# Altium schematic sheet Buck Boost Converter.SchDoc
size A4; SheetNumber: 1; SheetTotal: 1; SPICEModelCacheBIKMLFOA: <root> / <DocumentId>BIKMLFOA</DocumentId> / <CacheFrame Number="0"> / <Model Name="d188" Kind="MDL"> / <Text>***************************************************************** / * BAT17x Series Diode Model / .MODEL D188 D(IS=4n RS=3.3 N=1.03 XTI=2 EG=.65 / + CJO=415f M=.156 VJ=.115 FC=.5 BV=12 IBV=5U TT=25p)</Text> / </Model> / <Model Name="cap" Kind="MDL"> / <Text>*Default semiconductor capacitor / .MODEL CAP C()</Text> / </Model> / </CacheFrame> / </root>
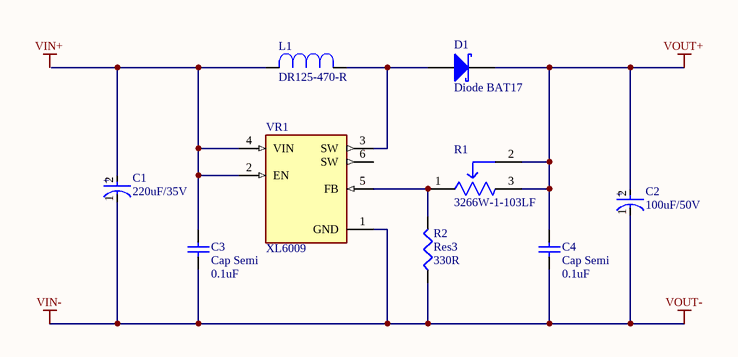
[diagram p0: Buck Boost Converter.SchDoc]

## Parts
C1  220uF/35V  [FP-HAG-MFG]
C2  100uF/50V  [FP-FKF-MFG]
C3  Cap Semi  value 0.1uF  [C1206]
C4  Cap Semi  value 0.1uF  [C1206]
D1  Diode BAT17  [SOT-23_N]
L1  DR125-470-R  [INDM125125X600N]
R1  3266W-1-103LF  [FP-3266W-MFG]
R2  Res3  value 330R  [J1-0603]
VR1  XL6009  [DPAK170P1435X465-6N]

## Nets
VIN-: C1.1(C) C2.1(C) C3.1 C4.1 R2.1 VR1.1(GND)  [also labelled VOUT-]
VOUT+: C2.2(A) C4.2 D1.3(K) R1.2(WIPER) R1.3(CW)
NetC1_2: C1.2(A) C3.2 L1.2 VR1.2(EN) VR1.4(VIN)
NetD1_1: D1.1(A) L1.1 VR1.3(SW)
NetR1_1: R1.1(CCW) R2.2 VR1.5(FB)

Not connected (* = marked no-connect by the designer): VR1 6(SW)

## Notes on the sheet
- Labels drawn without touching a wire or pin: VIN+
- (in symbol CMP-00287-25559144-1) +
- (in symbol CMP-05427-000032-1) +

## Library data of the parts
C1 = CMP-00287-25559144-1: EEEHA1V221AP Aluminum Electrolytic Capacitor, 220 uF, 35 V, ± 20%, 1000 hours @ 105°C, Radial Can - SMD; Lifecycle Status: Production; NexarPartId: 25559144
C2 = CMP-05427-000032-1: CAP ALUM 100UF 20% 50V SMD; Ripple Current (AC): 350mA; Impedance: 340mR; Life (Hours): 5000Hour; Leakage Current: 10mA; Voltage: 50V; Voltage Rating (DC): 50V; ESR (Equivalent Series Resistance): 340mR; Packaging: Tape and Reel; Radiation Hardening: No; Construction: Cylindrical; Case/Package: SMD/SMT; Contact Plating: Tin; Min Operating Temperature: -55°C; Lead Free: Lead Free; Mount: Surface Mount; Number of Pins: 2; Height: 10.2mm; Tolerance: 20%; Package Quantity: 1; Voltage Rating: 50V; Termination: SMD/SMT; Width: 10mm; Max Operating Temperature: 105°C; Height - Seated (Max): 0.402inch; RoHS Compliant: Yes; Ripple Current: 350mA; Length: 10.2mm; Capacitance: 100uF; Series: FK; REACH SVHC: No SVHC; Diameter: 8mm
C3 C4 = Cap Semi: Capacitor (Semiconductor SIM Model); Published: 8-Jun-2000; LatestRevisionDate: 29-May-2009; LatestRevisionNote: IPC-7351 Footprint Added.; PackageReference: C1206; Publisher: Altium Limited; PackageDescription: Chip Capacitor
D1 = Diode BAT17: Silicon RF Schottky Diode for Mixer Applications in the VHF/UHF Range; Note: Pin 2 is not connected and not drawn.; Published: 21-Mar-2003; LatestRevisionDate: 29-May-2009; LatestRevisionNote: IPC-7351 Footprint Added.; DatasheetVersion: Oct-1999; PackageVersion: Sep-2001; PackageReference: SOT-23; Publisher: Altium Limited; PackageDescription: 3-Pin SOT-23 Package 0.95 mm Pitch, 2.5 mm Lead Span; ComponentLink1Description: Manufacturer Link; ComponentLink1URL: http://www.infineon.com/; ComponentLink2Description: Datasheet; ComponentLink2URL: http://www.infineon.com/upload/Document/cmc_upload/documents/009/363/bat17series.pdf
L1 = DR125-470-R: Inductor, Wirewound, Shielded, 47uH, 74mOhm, 2.71A, Surface Mount, DR Series | Eaton Electronics DR125-470-R; SnapEDA_Link: https://www.snapeda.com/parts/DR125-470-R/Eaton/view-part/?ref=snap; Package: Non Standard Coiltronics / Eaton; Value: *; MF: Eaton; MP: DR125-470-R; Check_prices: https://www.snapeda.com/parts/DR125-470-R/Eaton/view-part/?ref=eda
R1 = CMP-07234-000016-1: TRIMMER 10K OHM 0.25W PC PIN TOP; Manufacturer: Bourns; Temperature Coefficient: 100ppm/°C; Tolerance: 10%; Value: 10kΩ; Description: 10 kOhms 0.25W, 1/4W PC Pins Through Hole Trimmer Potentiometer Cermet 12 Turn Top Adjustment; Standoff Height: 0.43mm; Device Class L3: Variable Resistors and Potentiometers; ComponentLink2URL: https://www.bourns.com/docs/Product-Datasheets/3266.pdf; ComponentLink2Description: Datasheet; Device Class L2: Resistors; Power Rating: 0.25W; Mouser Description: Trimmer Resistors - Through Hole 1/4 10Kohms 10% SQ W/Standoff Sealed; Category: Res; Digikey Description: TRIMMER 10K OHM 0.25W PC PIN TOP; Device Class L1: Passive Components; Octopart: https://octopart.com/3266w-1-103lf-bourns-81445; Height: 9.02mm; Temperature Range High: +125°C; Series: 3266; Temperature Range Low: -55°C; Composition: Cermet; Manufacturer Part Number: 3266W-1-103LF; Resistance: 10kΩ; Lead Free: Yes; RoHS: TRUE; Automotive: No; Package: 3266W; Temperature: -55°C to +125°C
R2 = Res3: Resistor; Published: 8-Jun-2000; LatestRevisionDate: 29-May-2009; LatestRevisionNote: IPC-7351 Footprint Added.; PackageReference: J1-0603; Publisher: Altium Limited; PackageDescription: Chip Resistor
VR1 = XL6009: The XL6009 regulator is a wide input range, current mode, DC/DC converter which is capable of generating either positive or negative output voltages.; MF: XLSEMI; Package: TO-263-5L XLSEMI; Price: None; Value: *; SnapEDA_Link: https://www.snapeda.com/parts/XL6009/XLSEMI/view-part/?ref=snap; MP: XL6009; Availability: Not in stock; Check_prices: https://www.snapeda.com/parts/XL6009/XLSEMI/view-part/?ref=eda